# Altium schematic sheet STB_FanControl.SchDoc: STB Sensor Board - Fan Controller
size A4; Author: mayerph; DrawnBy: mayerph; Organization: PBL; Revision: A; SheetNumber: 6; SheetTotal: 8
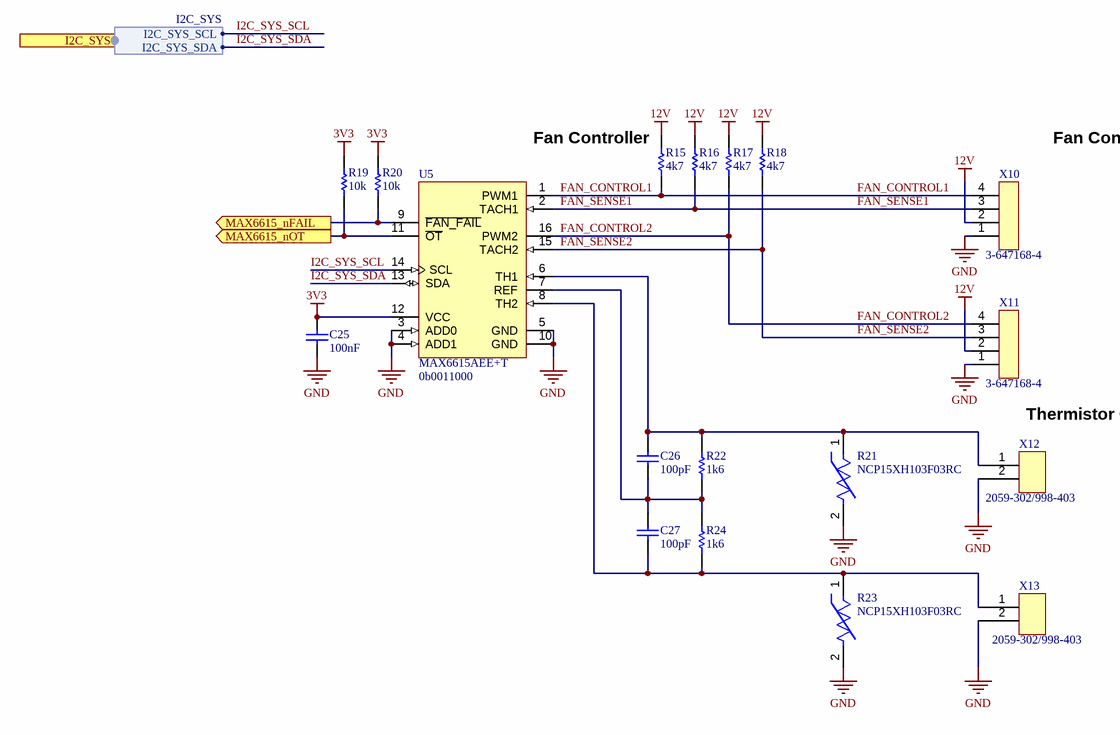
[diagram p0: STB_FanControl.SchDoc]

## Parts
C25  100nF  [CAPC1050X55X23LL05T13]
C26  100pF  [CAPC1005X56X25LL10T15]
C27  100pF  [CAPC1005X56X25LL10T15]
R15  4k7  [RESC1005X40X25LL05T10]
R16  4k7  [RESC1005X40X25LL05T10]
R17  4k7  [RESC1005X40X25LL05T10]
R18  4k7  [RESC1005X40X25LL05T10]
R19  10k  [RESC1005X40X25LL05T05]
R20  10k  [RESC1005X40X25LL05T05]
R21  NCP15XH103F03RC  [FP-NCP15-NCU15-0_05-IPC_C]
R22  1k6  [RESC1005X40X25LL05T10]
R23  NCP15XH103F03RC  [FP-NCP15-NCU15-0_05-IPC_C]
R24  1k6  [RESC1005X40X25LL05T10]
U5  MAX6615AEE+T  [MAXM-E16+1_M]
X10  3-647168-4  [3-647168-4]
X11  3-647168-4  [3-647168-4]
X12  2059-302/998-403  [2059-302/998-403]
X13  2059-302/998-403  [2059-302/998-403]

## Ports
I2C_SYS (harness I2C_SYS), MAX6615_nFAIL (out), MAX6615_nOT (out)

## Harnesses
I2C_SYS: I2C_SYS_SDA, I2C_SYS_SCL

## Nets
3V3: C25.2 R19.2 R20.2 U5.12(VCC)
12V: R15.2 R16.2 R17.2 R18.2 X10.2 X11.2
GND: C25.1 R21.2 R23.2 U5.3(ADD0) U5.4(ADD1) U5.5(GND) U5.10(GND) X10.1 X11.1 X12.2 X13.2
FAN_CONTROL1: R15.1 U5.1(PWM1) X10.4
FAN_CONTROL2: R17.1 U5.16(PWM2) X11.4
FAN_SENSE1: R16.1 U5.2(TACH1) X10.3
FAN_SENSE2: R18.1 U5.15(TACH2) X11.3
I2C_SYS_SCL: U5.14(SCL) ; port I2C_SYS.I2C_SYS_SCL
I2C_SYS_SDA: U5.13(SDA) ; port I2C_SYS.I2C_SYS_SDA
MAX6615_nFAIL: R20.1 U5.9(~{FAN_FAIL}) ; port MAX6615_nFAIL
MAX6615_nOT: R19.1 U5.11(~{OT}) ; port MAX6615_nOT
NetC26_1: C26.1 C27.2 R22.1 R24.2 U5.7(REF)
NetC26_2: C26.2 R21.1 R22.2 U5.6(TH1) X12.1
NetC27_1: C27.1 R23.1 R24.1 U5.8(TH2) X13.1

## Notes on the sheet
- Fan Controller
- (near X10) Fan Connector
- (near U5) 0b0011000
- Thermistor Connector
- 1
- 2
- 3
- 4
- A
- B
- C
- Project:
- D
- Date:
- Drawing number:
- Rev:
- Format:
- A4 Q
- Drawn by:
- Laboratory:
- Page
- Sheet:
- of
- File:

## Library data of the parts
C25 = CMP-2000-05439-1: Chip Capacitor, 100 nF, +/- 10%, 16 V, -55 to 125 degC, 0402 (1005 Metric), RoHS, Tape and Reel; Manufacturer: Samsung Electro-Mechanics; Manufacturer Part Number: CL05B104KO5NNNC; Dielectric: X7R; Rated Voltage: 16V; Dielectric Material: Ceramic; Multilayer: Yes; Case Size/Dimension: 0402; Tolerance (%): ±10%; Value: 100nF; Manufacturer URL: http://www.samsungsem.com/global/index.jsp; Datasheet URL: https://datasheet.ciiva.com/29198/458718-da-01-en-vs-kondensator-0402-29198423.pdf; Datasheet Version: Nov-10; Supplier 1: Digi-Key; Supplier Part Number 1: 1276-1001-6-ND; RoHS: Yes; Category: Ceramic Capacitors; Stock 1: 24854634; Pricing 1: 1=0.10000, 10=0.02400, 50=0.01300, 100=0.01050, 500=0.00752, 1000=0.00592, 2500=0.00538, 5000=0.00495 (USD); Mount: Surface Mount; Number of Pins: 2; Package Shape: Rectangular; Size Code: 0402; Terminal Finish: Nickel; Min Operating Temperature: -55°C; Max Operating Temperature: 125°C; JESD-609 Code: e3; Capacitor Type: Ceramic; Negative Tolerance: 10%; Packaging: Tape and Reel; Positive Tolerance: 10%; Rated DC Voltage (URdc): 16V; Temperature Characteristics Code: X7R; Termination: Wraparound; Package Style: SMTMeter; Length: 1mm; Width: 0.5mm; Height: 0.55mm; REACH SVHC: Yes; RoHS Compliant: Yes; ComponentLink1URL: https://datasheet.ciiva.com:443/pdfs/VipMasterIC/IC/SEMS/SEMS-S-A0008384515/SEMS-S-A0008872921-1.pdf?src-supplier=IHS+Markit; ComponentLink1Description: https://datasheet.ciiva.com:443/pdfs/VipMasterIC/IC/SEMS/SEMS-S-A0008384515/SEMS-S-A0008872921-1.pdf?src-supplier=IHS+Markit; ComponentLink2URL: https://datasheet.ciiva.com/26920/getdatasheetpartid-359683-26920169.pdf?src-supplier=Verical; ComponentLink2Description: https://datasheet.ciiva.com/26920/getdatasheetpartid-359683-26920169.pdf?src-supplier=Verical; ComponentLink3URL: https://datasheet.ciiva.com/29198/458718-da-01-en-vs-kondensator-0402-29198423.pdf?src-supplier=Conrad; ComponentLink3Description: https://datasheet.ciiva.com/29198/458718-da-01-en-vs-kondensator-0402-29198423.pdf?src-supplier=Conrad; ComponentLink4URL: https://datasheet.ciiva.com/26309/mlcc-catalogdownload2013-eng-26309003.pdf?src-supplier=Distrelec; ComponentLink4Description: https://datasheet.ciiva.com/26309/mlcc-catalogdownload2013-eng-26309003.pdf?src-supplier=Distrelec; ComponentLink5URL: https://datasheet.ciiva.com/16208/cl05b104kq5nnnc-16208343.pdf?src-supplier=Future+Electronics; ComponentLink5Description: https://datasheet.ciiva.com/16208/cl05b104kq5nnnc-16208343.pdf?src-supplier=Future+Electronics
C26 C27 = CMP-2008-02464-1: Manufacturer: AVX Interconnect / Elco; Part Number: 04023A101KAT2A; Dielectric Material: Ceramic; Multilayer: Yes; Negative Tolerance: 10%; Rated DC Voltage (URdc): 25V; Temperature Characteristics Code: C0G; Supplier 1: Digi-Key; Supplier Part Number 1: 478-12608-6-ND; Manufacturer Part Number: 04023A101KAT2A; RoHS: Yes; Category: Ceramic Capacitors; Stock 1: 32266; Pricing 1: 1=0.11000, 10=0.07800, 50=0.04240, 100=0.03460, 500=0.02474, 1000=0.01944, 2500=0.01768, 5000=0.01626 (USD); Mount: Surface Mount; Number of Pins: 2; Package Shape: Rectangular; Size Code: 0402; Terminal Finish: Nickel; Min Operating Temperature: -55°C; Max Operating Temperature: 125°C; JESD-609 Code: e3; Value: 100pF; Capacitor Type: Ceramic; Packaging: Tape and Reel; Positive Tolerance: 10%; Termination: Wraparound; Package Style: SMTMeter; Length: 1mm; Width: 0.5mm; Height: 0.56mm; REACH SVHC: Yes; RoHS Compliant: Yes; ComponentLink1URL: https://datasheet.ciiva.com:443/pdfs/VipMasterIC/IC/AVXC/AVXC-S-A0008899940/AVXC-S-A0008899940-1.pdf?src-supplier=IHS+Markit; ComponentLink1Description: https://datasheet.ciiva.com:443/pdfs/VipMasterIC/IC/AVXC/AVXC-S-A0008899940/AVXC-S-A0008899940-1.pdf?src-supplier=IHS+Markit; ComponentLink2URL: https://datasheet.ciiva.com/26949/getdatasheetpartid-709922-26949850.pdf?src-supplier=Verical; ComponentLink2Description: https://datasheet.ciiva.com/26949/getdatasheetpartid-709922-26949850.pdf?src-supplier=Verical; ComponentLink3URL: https://datasheet.ciiva.com/206/ccog-206339.pdf?src-supplier=Digi-Key; ComponentLink3Description: https://datasheet.ciiva.com/206/ccog-206339.pdf?src-supplier=Digi-Key; ComponentLink4URL: https://datasheet.ciiva.com/7348/759117-7348584.pdf?src-supplier=Newark; ComponentLink4Description: https://datasheet.ciiva.com/7348/759117-7348584.pdf?src-supplier=Newark; ComponentLink5URL: https://datasheet.ciiva.com/2990/ccog-2990123.pdf?src-supplier=Avnet; ComponentLink5Description: https://datasheet.ciiva.com/2990/ccog-2990123.pdf?src-supplier=Avnet; ComponentLink6URL: https://datasheet.ciiva.com/28453/1796416-28453629.pdf?src-supplier=Element14; ComponentLink6Description: https://datasheet.ciiva.com/28453/1796416-28453629.pdf?src-supplier=Element14
R15-R18 = CMP-1011-00586-2: Manufacturer: Yageo / Phycomp; Part Number: RC0402FR-074K7L; Tolerance: 1%; Rated Power Dissipation (P): 62.5mW; Rated Temperature: 70°C; Value: 4.7 kOhm; Temperature Coefficient: 100ppm/°C; Working Voltage: 50V; Additional Feature: LASER TRIMMABLE; Package Height: 0.35mm; Package Length: 1mm; Package Width: 0.5mm; Supplier 1: Digi-Key; Supplier Part Number 1: 311-4.7KLRDKR-ND; Manufacturer Part Number: RC0402FR-074K7L; RoHS: Yes; Category: Chip SMD Resistors; Stock 1: 23638739; Pricing 1: 1=0.10000, 10=0.01500, 100=0.00600, 1000=0.00267, 2500=0.00232, 5000=0.00192 (USD); Mount: Surface Mount; Number of Pins: 2; Package Shape: Rectangular; Size Code: 0402; Terminal Finish: Nickel; Min Operating Temperature: -55°C; Max Operating Temperature: 155°C; Resistor Type: FIXED RESISTOR; Packaging: Tape and Reel; Technology: METAL GLAZE/THICK FILM; Termination: Wraparound; JESD-609 Code: e3; Construction: Chip; Package Style: SMTMeter; REACH SVHC: Yes; RoHS Compliant: Yes; ComponentLink1URL: https://datasheet.ciiva.com:443/pdfs/VipMasterIC/IC/YAGO/YAGO-S-A0008145938/YAGO-S-A0008145938-1.pdf?src-supplier=IHS+Markit; ComponentLink1Description: https://datasheet.ciiva.com:443/pdfs/VipMasterIC/IC/YAGO/YAGO-S-A0008145938/YAGO-S-A0008145938-1.pdf?src-supplier=IHS+Markit; ComponentLink2URL: https://datasheet.ciiva.com/22661/1686128-22661342.pdf?src-supplier=Element14; ComponentLink2Description: https://datasheet.ciiva.com/22661/1686128-22661342.pdf?src-supplier=Element14; ComponentLink3URL: https://datasheet.ciiva.com/7850/1018594-7850022.pdf?src-supplier=Element14; ComponentLink3Description: https://datasheet.ciiva.com/7850/1018594-7850022.pdf?src-supplier=Element14; ComponentLink4URL: https://datasheet.ciiva.com/7850/1018594-7850023.pdf?src-supplier=Element14; ComponentLink4Description: https://datasheet.ciiva.com/7850/1018594-7850023.pdf?src-supplier=Element14; ComponentLink5URL: https://datasheet.ciiva.com/15215/getdatasheetpartid-328119-15215035.pdf?src-supplier=Verical; ComponentLink5Description: https://datasheet.ciiva.com/15215/getdatasheetpartid-328119-15215035.pdf?src-supplier=Verical
R19 R20 = CMP-2000-07588-1: Chip Resistor, 10 KOhm, +/- 1%, 0.1 W, -55 to 155 degC, 0402 (1005 Metric), RoHS, Tape and Reel; Manufacturer: Panasonic; Manufacturer Part Number: ERJ-2RKF1002X; Power Rating: 100mW; Voltage Rating: 50V; Value: 10 KOhm; Case\/Package: 0402; Temperature Coefficient: 100ppm\/degreesC; Rated Temperature: 70°C; Package Height: 0.35mm; Package Length: 1mm; Package Width: 0.5mm; Reference Standard: AEC-Q200; RoHSCompliant: True; Lead Free: LeadFree; Package Quantity: 1; Contact Plating: Tin; Length: 1mm; Radiation Hardening: No; REACH SVHC: NoSVHC; Max Operating Temperature: 155degC; Depth: 0.5mm; Case Code (Imperial): 0402; Military Standard: Not; Package Description: 2-Pin Surface Mount Device, Body 1 x 0.5 mm; Termination: SMD/SMT; Case Code (Metric): 1005; Height: 0.35mm; Packaging: TapeandReel; Voltage Rating (DC): 50V; Package Reference: 402; Number of Pins: 2; Tolerance: 1%; Mounting Technology: SurfaceMount; Width: 0.02inch; Mount: SurfaceMount; Datasheet URL: https://industrial.panasonic.com/cdbs/www-data/pdf/RDA0000/AOA0000C304.pdf; Composition: ThickFilm; Datasheet Version: 02/2017; Manufacturer URL: http://www.panasonic.com/; Max Power Dissipation: 100mW; Number of Terminations: 2; Min Operating Temperature: -55degC; Supplier 1: Digi-Key; Supplier Part Number 1: P10.0KLDKR-ND; RoHS: Yes; Category: Chip SMD Resistors; Stock 1: 108; Pricing 1: 1=0.10000, 10=0.03300, 100=0.01330, 1000=0.00599, 2500=0.00520, 5000=0.00429 (USD); Size Code: 0402; Terminal Finish: Nickel; Package Shape: Rectangular; Resistor Type: FIXED RESISTOR; Rated Power Dissipation (P): 100mW; Technology: METAL GLAZE/THICK FILM; Working Voltage: 50V; Construction: Rectangular; Package Style: SMTMeter; JESD-609 Code: e3; RoHS Compliant: Yes; ComponentLink1URL: https://datasheet.ciiva.com:443/pdfs/VipMasterIC/IC/PANA/PANA-S-A0009889626/PANA-S-A0009889626-1.pdf?src-supplier=IHS+Markit; ComponentLink1Description: https://datasheet.ciiva.com:443/pdfs/VipMasterIC/IC/PANA/PANA-S-A0009889626/PANA-S-A0009889626-1.pdf?src-supplier=IHS+Markit; ComponentLink2URL: https://datasheet.ciiva.com/11821/0900766b80f80784-11821171.pdf?src-supplier=RSComponents; ComponentLink2Description: https://datasheet.ciiva.com/11821/0900766b80f80784-11821171.pdf?src-supplier=RSComponents; ComponentLink3URL: https://datasheet.ciiva.com/27055/1987020-27055643.pdf?src-supplier=Jameco; ComponentLink3Description: https://datasheet.ciiva.com/27055/1987020-27055643.pdf?src-supplier=Jameco; ComponentLink4URL: https://datasheet.ciiva.com/43467/1678782-43467402.pdf?src-supplier=Farnell; ComponentLink4Description: https://datasheet.ciiva.com/43467/1678782-43467402.pdf?src-supplier=Farnell; ComponentLink5URL: https://datasheet.ciiva.com/28514/1678782-28514185.pdf?src-supplier=Element14; ComponentLink5Description: https://datasheet.ciiva.com/28514/1678782-28514185.pdf?src-supplier=Element14; ComponentLink6URL: https://datasheet.ciiva.com/24023/aoa0000ce2-24023017.pdf?src-supplier=Mouser; ComponentLink6Description: https://datasheet.ciiva.com/24023/aoa0000ce2-24023017.pdf?src-supplier=Mouser; ComponentLink7URL: https://datasheet.ciiva.com/16782/70260748-16782590.pdf?src-supplier=Allied+Electronics; ComponentLink7Description: https://datasheet.ciiva.com/16782/70260748-16782590.pdf?src-supplier=Allied+Electronics; ComponentLink8URL: https://datasheet.ciiva.com/16786/70260748-16786734.pdf?src-supplier=Allied+Electronics; ComponentLink8Description: https://datasheet.ciiva.com/16786/70260748-16786734.pdf?src-supplier=Allied+Electronics; ComponentLink9URL: https://datasheet.ciiva.com/9194/aoa0000ce2-9194142.pdf?src-supplier=Avnet; ComponentLink9Description: https://datasheet.ciiva.com/9194/aoa0000ce2-9194142.pdf?src-supplier=Avnet; ComponentLink10URL: https://datasheet.ciiva.com/16199/aoa0000ce2-16199478.pdf?src-supplier=Future+Electronics; ComponentLink10Description: https://datasheet.ciiva.com/16199/aoa0000ce2-16199478.pdf?src-supplier=Future+Electronics; ComponentLink11URL: https://datasheet.ciiva.com/48531/aoa0000ce2-48531069.pdf?src-supplier=Avnet; ComponentLink11Description: https://datasheet.ciiva.com/48531/aoa0000ce2-48531069.pdf?src-supplier=Avnet; ComponentLink12URL: https://datasheet.ciiva.com/30201/aoa0000ce2-30201022.pdf?src-supplier=Onlinecomponents.com; ComponentLink12Description: https://datasheet.ciiva.com/30201/aoa0000ce2-30201022.pdf?src-supplier=Onlinecomponents.com
R21 R23 = CMP-06022-000003-3: NTC Thermistor for Temperature Sensor, 0402, 10kΩ, 1%, 0.1mA, 5V; Manufacturer: Murata; Max Power Dissipation: 100mW; Value: 10 kOhm; Current Rating: 310uA; Rated Temperature: 25°C; Thermistor Application: TEMPERATURE COMPENSATION; Length: 1mm; Min Operating Temperature: -40°C; Max Operating Temperature: 125°C; Resistance Tolerance: 1%; Lead Free: Lead Free; Radiation Hardening: No; Case Code (Imperial): 0402; Depth: 0.5mm; Tolerance: 1%; Packaging: Tape and Reel; Package Quantity: 10000; Series: NCP; Number of Pins: 2; Power Rating: 100mW; Case/Package: 0402; Case Code (Metric): 1005; Height: 0.5mm; Termination: SMD/SMT; RoHS Compliant: Yes; REACH SVHC: No SVHC; Mount: Surface Mount; Supplier 1: Digi-Key; Supplier Part Number 1: 490-4801-1-ND; Manufacturer Part Number: NCP15XH103F03RC; RoHS: Yes; Category: Thermistors; Stock 1: 413279; Pricing 1: 1=0.16000, 5=0.14200, 10=0.12600, 25=0.11280, 50=0.09940, 100=0.08470, 500=0.07000, 1000=0.05861, 5000=0.05210 (USD); Package Shape: Rectangular; Terminal Finish: Nickel; Resistor Type: NTC THERMISTOR; Rated Power Dissipation (P): 100mW; Terminal Placement: Dual Ended; JESD-609 Code: e3; ComponentLink1URL: https://datasheet.ciiva.com:443/pdfs/VipMasterIC/IC/MURE/MURE-S-A0003530701/MURE-S-A0003530701-1.pdf?src-supplier=IHS+Markit; ComponentLink1Description: https://datasheet.ciiva.com:443/pdfs/VipMasterIC/IC/MURE/MURE-S-A0003530701/MURE-S-A0003530701-1.pdf?src-supplier=IHS+Markit
R22 R24 = CMP-1011-00531-2: Manufacturer: Yageo / Phycomp; Part Number: RC0402FR-071K6L; Tolerance: 1%; Rated Power Dissipation (P): 62.5mW; Value: 1.6 kOhm; Temperature Coefficient: 100ppm/°C; Working Voltage: 50V; Rated Temperature: 70°C; Additional Feature: LASER TRIMMABLE; Package Height: 0.35mm; Package Length: 1mm; Package Width: 0.5mm; Supplier 1: Digi-Key; Supplier Part Number 1: YAG3045CT-ND; Manufacturer Part Number: RC0402FR-071K6L; RoHS: Yes; Category: Chip SMD Resistors; Stock 1: 492226; Pricing 1: 1=0.10000, 10=0.01500, 100=0.00600, 1000=0.00267, 2500=0.00232, 5000=0.00192 (USD); Mount: Surface Mount; Number of Pins: 2; Size Code: 0402; Terminal Finish: Nickel; Package Shape: Rectangular; Min Operating Temperature: -55°C; Max Operating Temperature: 155°C; Resistor Type: FIXED RESISTOR; Technology: METAL GLAZE/THICK FILM; Construction: Chip; Package Style: SMTMeter; Packaging: Tape and Reel; Termination: Wraparound; JESD-609 Code: e3; REACH SVHC: Yes; RoHS Compliant: Yes; ComponentLink1URL: https://datasheet.ciiva.com:443/pdfs/VipMasterIC/IC/YAGO/YAGO-S-A0008145938/YAGO-S-A0008145938-1.pdf?src-supplier=IHS+Markit; ComponentLink1Description: https://datasheet.ciiva.com:443/pdfs/VipMasterIC/IC/YAGO/YAGO-S-A0008145938/YAGO-S-A0008145938-1.pdf?src-supplier=IHS+Markit; ComponentLink2URL: https://datasheet.ciiva.com/7849/1018594-7849865.pdf?src-supplier=Element14; ComponentLink2Description: https://datasheet.ciiva.com/7849/1018594-7849865.pdf?src-supplier=Element14; ComponentLink3URL: https://datasheet.ciiva.com/7849/1018594-7849866.pdf?src-supplier=Element14; ComponentLink3Description: https://datasheet.ciiva.com/7849/1018594-7849866.pdf?src-supplier=Element14; ComponentLink4URL: https://datasheet.ciiva.com/8895/pyu-rc0402-51-rohs-l-6-8895221.pdf?src-supplier=Avnet; ComponentLink4Description: https://datasheet.ciiva.com/8895/pyu-rc0402-51-rohs-l-6-8895221.pdf?src-supplier=Avnet; ComponentLink5URL: https://datasheet.ciiva.com/15189/getdatasheetpartid-329238-15189373.pdf?src-supplier=Verical; ComponentLink5Description: https://datasheet.ciiva.com/15189/getdatasheetpartid-329238-15189373.pdf?src-supplier=Verical
U5 = CMP-0253-00230-1: Dual-Channel Temperature Monitors and Fan-Speed Controller with Thermistor Inputs, -40 to 125 degC, 16-Pin SOP (E16+1), Pb-Free, Tape and Reel; Manufacturer: Maxim; Fan Cntrl.: PWM; Fan Controller Functions: Fan Failure Detector; Interface: 2-Wire/I2C/SMBus; Package Body Material: Plastic; Package Shape/Style: Rectangular; Number of Bits: 8; Operating Current-Max: 1mA; Output Interface Type: 2-Wire; Package Equivalence Code: SSOP16,.25; Power Supplies: 3.3/5V; Sensors/Transducers Type: TEMPERATURE SENSOR,SWITCH/DIGITAL OUTPUT,SERIAL; Max Supply Voltage: 5.5V; Min Supply Voltage: 3V; Body Breadth: 3.9inch; Body Height: 1.64mm; Body Length or Diameter: 8.65mm; ComponentLink3Description: Package Specification; PackageDescription: 16-Pin Quarter Small-Outline Package (E16+1), Body 4.90 x 3.89 mm, Pitch 0.635 mm; ComponentLink2URL: http://datasheets.maximintegrated.com/en/ds/MAX6615-MAX6616.pdf; PackageReference: E16+1; ComponentLink3URL: http://pdfserv.maximintegrated.com/package_dwgs/21-0055.PDF; Packing: Tape and Reel; Code_JEDEC: MO137; Mounting Technology: Surface Mount; PartNumber: MAX6615AEE+T; ComponentLink1URL: http://www.maximintegrated.com/; Generic Part Number: MAX6615; DatasheetVersion: Rev. 2; PackageVersion: Rev. K, 04/2012; ComponentLink1Description: Manufacturer URL; ComponentLink2Description: Datasheet; Supplier 1: Digi-Key; Supplier Part Number 1: MAX6615AEE+TCT-ND; Manufacturer Part Number: MAX6615AEE+T; RoHS: Yes; Category: Power Management ICs; Mount: Surface Mount; Number of Pins: 16; Terminal Finish: Tin; Min Operating Temperature: -40°C; Max Operating Temperature: 125°C; JESD-609 Code: e3; Technology: BICMOS; Termination: Solder; REACH SVHC: Yes; RoHS Compliant: Yes; ComponentLink4URL: https://datasheet.ciiva.com:443/pdfs/VipMasterIC/IC/MAXM/MAXMS09113/MAXMS09113-1.pdf?src-supplier=IHS+Markit; ComponentLink4Description: https://datasheet.ciiva.com:443/pdfs/VipMasterIC/IC/MAXM/MAXMS09113/MAXMS09113-1.pdf?src-supplier=IHS+Markit; ComponentLink5URL: https://datasheet.ciiva.com/3279/max6615-max6616-3279622.pdf?src-supplier=Avnet; ComponentLink5Description: https://datasheet.ciiva.com/3279/max6615-max6616-3279622.pdf?src-supplier=Avnet; ComponentLink6URL: https://datasheet.ciiva.com/14083/max6615-max6616-14083689.pdf?src-supplier=Digi-Key; ComponentLink6Description: https://datasheet.ciiva.com/14083/max6615-max6616-14083689.pdf?src-supplier=Digi-Key; ComponentLink7URL: https://datasheet.ciiva.com/13952/max6615-max6616-13952058.pdf?src-supplier=Digi-Key; ComponentLink7Description: https://datasheet.ciiva.com/13952/max6615-max6616-13952058.pdf?src-supplier=Digi-Key; ComponentLink8URL: https://datasheet.ciiva.com/13952/max6615-max6616-13952059.pdf?src-supplier=Digi-Key; ComponentLink8Description: https://datasheet.ciiva.com/13952/max6615-max6616-13952059.pdf?src-supplier=Digi-Key
X10 X11 = 3-647168-4: Board Connector, 4 Contact(s), 1 Row(s), Male, Straight, 0.1 inch Pitch, Locking, Black Insulator, Plug; Manufacturer: TE Connectivity; Manufacturer Part Number: 3-647166-4; Manufacturer Series: 647166; Option: General Purpose; Filter Feature: No; Number of Rows Loaded: 1; Number of Contacts: 4; Contact Pattern: RECTANGULAR; Contact Resistance: 10mR; Contact Style: SQ PIN-SKT; Dielectric Withstanding Voltage (AC): 750V; Durability: 25Cycles; Insertion Force-Max: 8.896N; Insulation Resistance: 5GR; Polarization Key: POLARIZED HOUSING; Withdrawl Force-Min: 3.614N; Number Of PCB Rows: 2; PCB Contact Pattern: STAGGERED; Body Breadth: 0.25inch; Body Depth: 0.347inch; Body Length: 0.4inch; Mounting Option 2: FRICTION LOCK; PCB Contact Row Spacing: 2.9972mm; Reference Standard: UL; Reliability: COMMERCIAL; Supplier 1: Digi-Key; Supplier Part Number 1: A110803-ND; RoHS: Yes; Category: Connectors; Stock 1: 3619; Pricing 1: 1=2.42000, 10=2.10700, 100=1.88280, 500=1.56900, 1000=1.34485, 5000=1.19243 (USD); Mount: Board; Contact Finish - Mating: NOT SPECIFIED; Insulation Color: Black; Insulation Material: Nylon; Min Operating Temperature: -55°C; Max Operating Temperature: 105°C; Connector Type: BOARD CONNECTOR; Contact Gender: Male; Mixed Contacts: No; JESD-609 Code: e3; Termination: SMD/SMT; Body/Shell Style: PLUG; Mounting Style: STRAIGHT; Number Of Connectors: 1; Mating Contact Pitch: 0.1inch; Mounting Option 1: LOCKING; Terminal Pitch: 2.54mm; RoHS Compliant: Yes; DIN Conformance: No; IEC Conformance: No; MIL Conformance: No; Reach SVHC Compliant: Yes; ComponentLink1URL: https://datasheet.ciiva.com:443/pdfs/VipMasterIC/IC/TYEL/TYEL-S-A0008869674/TYEL-S-A0008865685-1.pdf?src-supplier=IHS+Markit; ComponentLink1Description: https://datasheet.ciiva.com:443/pdfs/VipMasterIC/IC/TYEL/TYEL-S-A0008869674/TYEL-S-A0008865685-1.pdf?src-supplier=IHS+Markit; ComponentLink2URL: https://datasheet.ciiva.com/16216/eng-ds-82056-mta-0608-16216388.pdf?src-supplier=Future+Electronics; ComponentLink2Description: https://datasheet.ciiva.com/16216/eng-ds-82056-mta-0608-16216388.pdf?src-supplier=Future+Electronics; ComponentLink3URL: https://datasheet.ciiva.com/9525/eng-ds-82056-mta-0608-9525559.pdf?src-supplier=Avnet; ComponentLink3Description: https://datasheet.ciiva.com/9525/eng-ds-82056-mta-0608-9525559.pdf?src-supplier=Avnet
X12 X13 = 2059-302/998-403: Barrier Strip Terminal Block, 3A, 0.34mm2, 1 Row(s), 1 Deck(s); Manufacturer: WAGO; Fastening Method: PUSH-IN; Number of Decks: 1; Number of Ways: 2; Voltage Rating: 250V; Wire/Cable Gauge: 22AWG; Safety Approval: UL; Supplier 1: Digi-Key; Manufacturer Part Number: 2059-302/998-403; RoHS: Yes; Category: Connectors; Stock 1: 17368; Pricing 1: 1=1.25000, 10=0.87800, 25=0.81880, 50=0.74320, 100=0.73990, 250=0.62484, 500=0.59194 (USD); Mount: Board; Number of Rows: 1; Current Rating: 3A; Terminal and Terminal Block Type: BARRIER STRIP TERMINAL BLOCK; Wire Cross Section: 0.34mm2; REACH SVHC: Yes; RoHS Compliant: Yes; ComponentLink1URL: https://datasheet.ciiva.com:443/pdfs/VipMasterIC/IC/WAGO/WAGO-S-A0007107760/WAGO-S-A0007107948-1.pdf?src-supplier=IHS+Markit; ComponentLink1Description: https://datasheet.ciiva.com:443/pdfs/VipMasterIC/IC/WAGO/WAGO-S-A0007107760/WAGO-S-A0007107948-1.pdf?src-supplier=IHS+Markit; ComponentLink2URL: https://datasheet.ciiva.com/41441/001208172-da-01-de-smd-leiterplattenklemme-2059-302-998-404-41441808.pdf?src-supplier=Conrad; ComponentLink2Description: https://datasheet.ciiva.com/41441/001208172-da-01-de-smd-leiterplattenklemme-2059-302-998-404-41441808.pdf?src-supplier=Conrad; ComponentLink3URL: https://datasheet.ciiva.com/46435/1860449-46435420.pdf?src-supplier=Element14; ComponentLink3Description: https://datasheet.ciiva.com/46435/1860449-46435420.pdf?src-supplier=Element14; Supplier Part Number 1: 2946-2059-302/998-403CT-ND